# Altium schematic sheet RS485.SchDoc
size A4; SheetNumber: 3; SheetTotal: 7
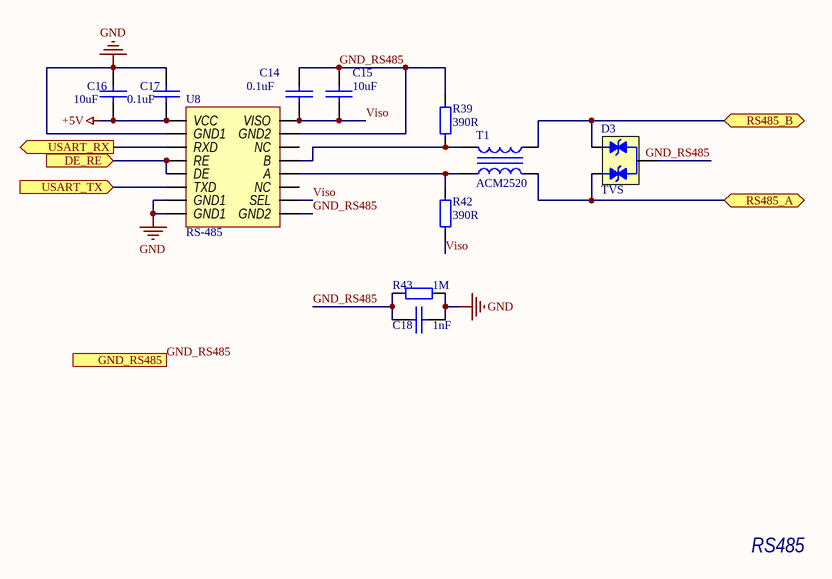
[diagram p0: RS485.SchDoc]

## Parts
C14  0.1uF  [0603 Capicator]
C15  10uF  [0603 Capicator]
C16  10uF  [0603 Capicator]
C17  0.1uF  [0603 Capicator]
C18  1nF  [0603 Capicator]
D3  TVS  [SOT-23]
R39  390R  [1206 RESISTOR]
R42  390R  [1206 RESISTOR]
R43  1M  [0603 Resistor]
T1  ACM2520  [ACM2520]
U8  RS-485  [SOIC16W]

## Ports
DE_RE (in), GND_RS485, RS485_A (bidir), RS485_B (bidir), USART_RX (out), USART_TX (in)

## Nets
+5V: C16.2 C17.1 U8.1(VCC)
GND: C16.1 C17.2 C18.2 R43.2 U8.2(GND1) U8.7(GND1) U8.8(GND1)
DE_RE: U8.4(RE) U8.5(DE) ; port DE_RE
GND_RS485: C14.2 C15.2 C18.1 D3.3 R39.2 R43.1 U8.9(GND2) U8.15(GND2) ; port GND_RS485
RS485_A: D3.2 T1.3 ; port RS485_A
RS485_B: D3.1 T1.4 ; port RS485_B
USART_RX: U8.3(RXD) ; port USART_RX
USART_TX: U8.6(TXD) ; port USART_TX
Viso: C14.1 C15.1 R42.1 U8.10(SEL) U8.16(VISO)
NetR39_1: R39.1 T1.1 U8.13(B)
NetR42_2: R42.2 T1.2 U8.12(A)

Not connected (* = marked no-connect by the designer): U8 11(NC) 14(NC)

## Notes on the sheet
- RS485

## Library data of the parts
C14 C17 = Cap 0.1uF (0603): 0.1uF X7R 16V 10% 0603; Manufacturer: Murata Manufacturing; Part Number: GRM188R71C104KA01D; Type: Capacitor; ComponentLink1Description: Chip&Dip; ComponentLink1URL: https://www.chipdip.ru/product/grm188r71c104ka01d
C15 C16 = Cap 10uF (0603): 10uF X5R 25V 20% 0603; Manufacturer: Murata Manufacturing; Part Number: GRM188R61E106M; Type: Capacitor; ComponentLink1Description: Chip&Dip; ComponentLink1URL: https://www.chipdip.ru/product/grm188r61e106m
C18 = Cap 1nF (0603): X7R 1nF 100V 10% 0603; Manufacturer: Murata Manufacturing; Part Number: GRM188R72A102KA01D; Type: Capacitor; ComponentLink1Description: Chip&Dip; ComponentLink1URL: https://www.chipdip.ru/product/grm188r72a102ka01d
D3 = TVS Diode Arrays: The SM24CANB TVS Diode Array is designed to protect automotive Controller Area Network (CAN) lines from damage due to electrostatic discharge (ESD), electrical fast transient (EFT), and other overvoltage transients.; Part Number: SM24CANB-02HTG; Manufacturer: Littelfuse; Type: Diode; ComponentLink1Description: DataSheet; ComponentLink1URL: https://m.littelfuse.com/~/media/electronics/datasheets/tvs_diode_arrays/littelfuse_tvs_diode_array_sm24canb_datasheet.pdf.pdf; ComponentLink2Description: Chip&Dip; ComponentLink2URL: https://www.chipdip.ru/product1/8001779022
R39 R42 = Res 390R (1206): 0.25W 1206 390R; Part Number: RC1206JR-07390KL; Manufacturer: Taiwan; Type: Resistor; ComponentLink1Description: Chip&Dip; ComponentLink1URL: https://www.chipdip.ru/product0/8023504304
R43 = Res 1M (0603): 0.1W 0603 1M, 1%; Part Number: RC0603FR-071ML; Manufacturer: Taiwan; Type: Resistor; ComponentLink1Description: Chip&Dip; ComponentLink1URL: https://www.chipdip.ru/product0/9000079784
T1 = ACM2520: Common mode filters / Automotive signal line (for power train/safety); Manufacturer: TDK; Part Number: ACM2520-301-2P-T002; Type: Inductor; ComponentLink1Description: DataSheet; ComponentLink1URL: https://product.tdk.com/system/files/dam/doc/product/emc/emc/cmf_cmc/catalog/cmf_commercial_signal_acm2520_en.pdf; ComponentLink2Description: ChipDip; ComponentLink2URL: https://www.chipdip.ru/product0/8008480337?ysclid=lw4t4jsj9a923851487
U8 = TDA51S485HC: Isolated RS-485 Half-Duplex tranciever; Manufacturer: Mornsun; Type: IC; Part Number: TDA51S485HC; ComponentLink1Description: ChipDip; ComponentLink1URL: https://www.chipdip.ru/product0/8009281357; ComponentLink2Description: Datasheet; ComponentLink2URL: https://www.mornsun-power.com/html/pdf/TDA51S485HC.html